# EAGLE design arduino_shield (EAGLE 6.6.0)

## Sheet 1 of 2: Arduino Sheild
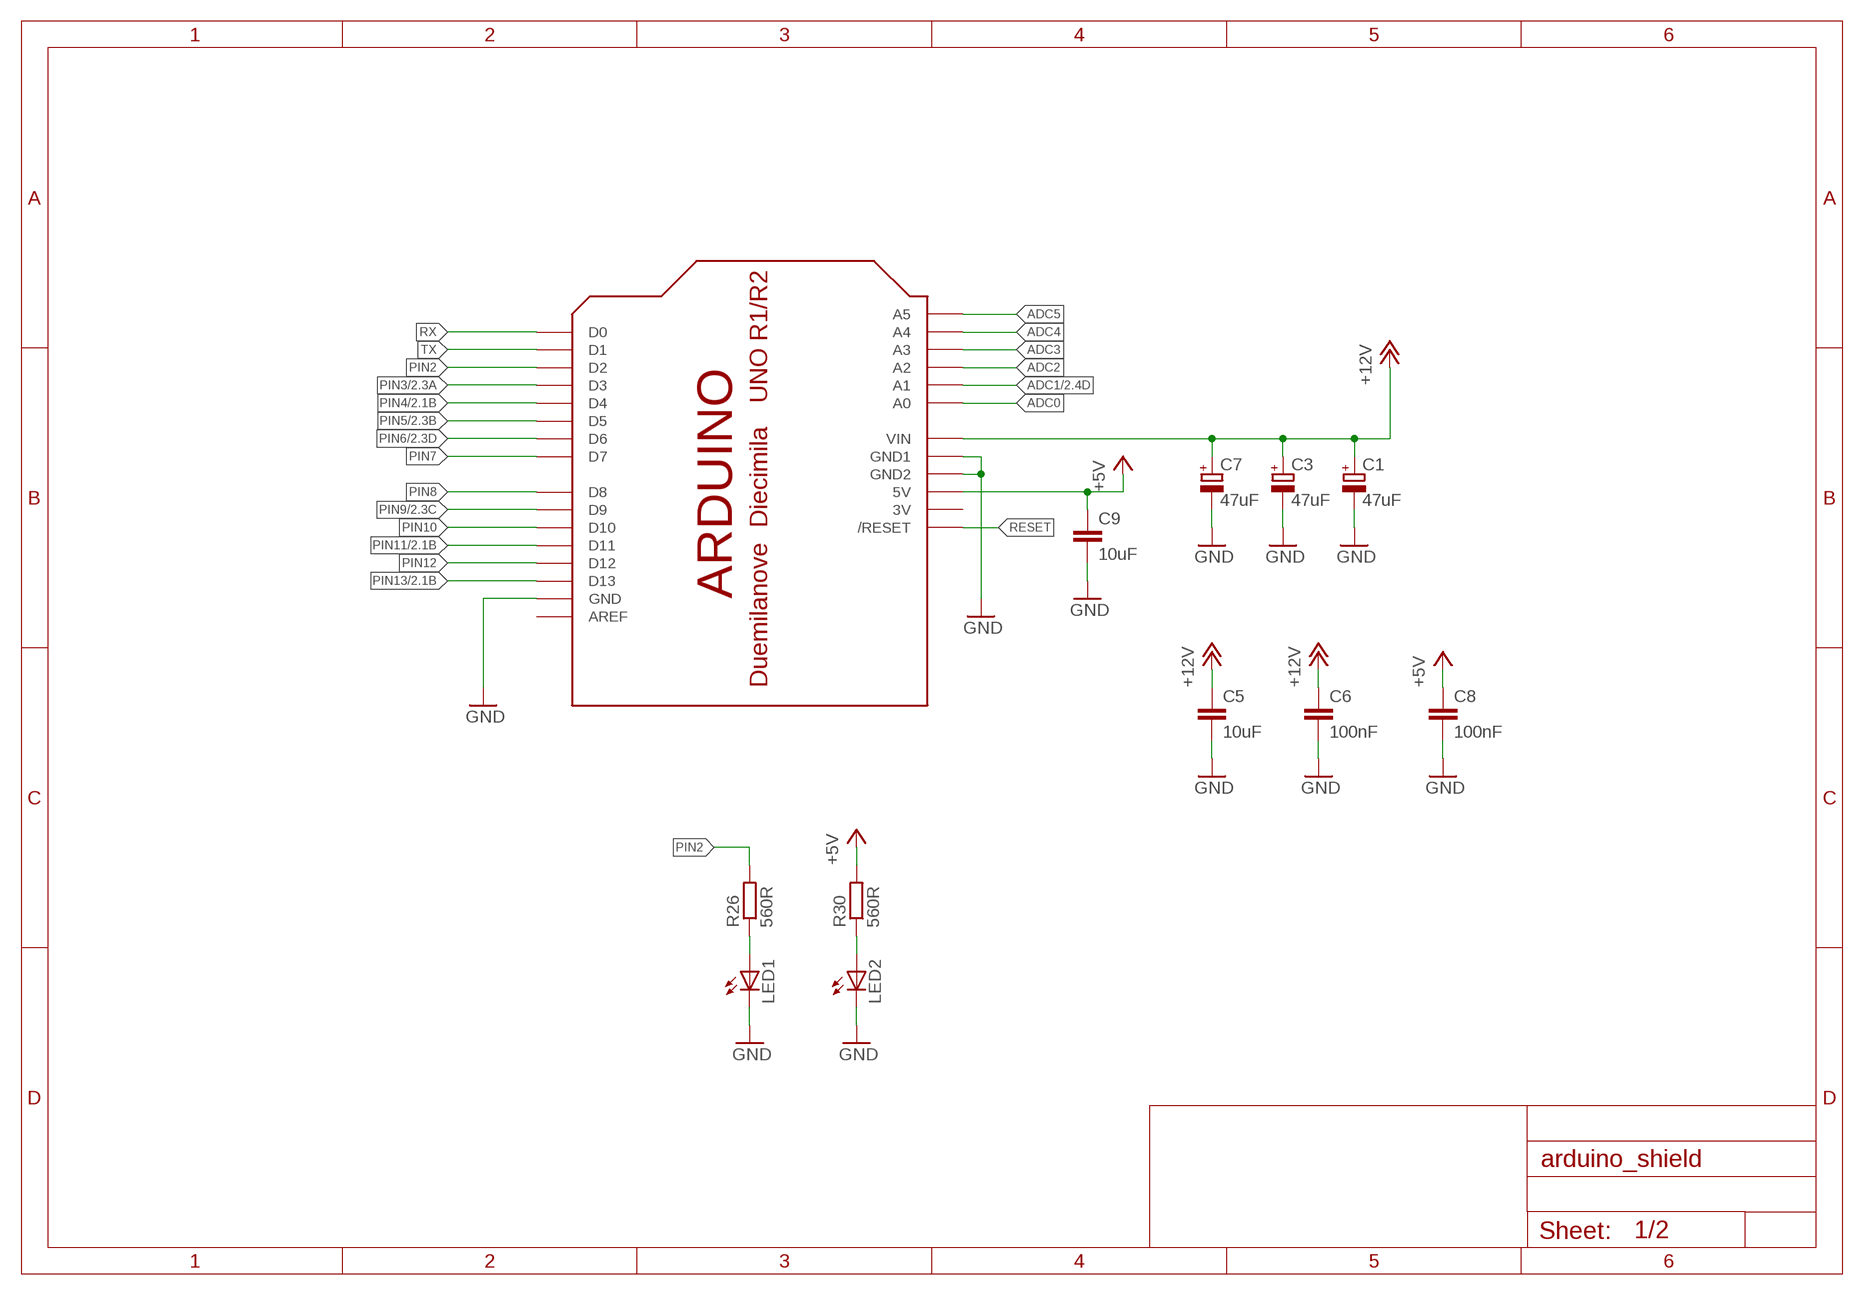
[diagram p0: schematic, sheet 1]

### Parts
C1  47uF  CPOL-EUE2.5-5  [E2,5-5]
C3  47uF  CPOL-EUE2.5-5  [E2,5-5]
C5  10uF  C-EUC0805K  [C0805K]
C6  100nF  C-EUC0805K  [C0805K]
C7  47uF  CPOL-EUE2.5-5  [E2,5-5]
C8  100nF  C-EUC0805K  [C0805K]
C9  10uF  C-EUC0805K  [C0805K]
GND  ARDUINOUNO  [ARDUINO]
LED1  LEDCHIP-LED0805  [CHIP-LED0805]
LED2  LEDCHIP-LED0805  [CHIP-LED0805]
R26  560R  R-EU_R0805  [R0805]
R30  560R  R-EU_R0805  [R0805]

### Nets
+5V: C8.1 C9.1 GND.5V R30.2 ; also sheet 2
+12V: C1.+ C3.+ C5.1 C6.1 C7.+ GND.VIN ; also sheet 2
ADC0: GND.A0
ADC1: GND.A1 ; also sheet 2
ADC2: GND.A2
ADC3: GND.A3
ADC4: GND.A4
ADC5: GND.A5
GND: C1.- C3.- C5.2 C6.2 C7.- C8.2 C9.2 GND.GND GND.GND1 GND.GND2 LED1.C LED2.C ; also sheet 2
N$8: LED1.A R26.1
N$9: LED2.A R30.1
PIN2: GND.D2 R26.2
PIN3: GND.D3 ; also sheet 2
PIN4: GND.D4 ; also sheet 2
PIN5: GND.D5 ; also sheet 2
PIN6: GND.D6 ; also sheet 2
PIN7: GND.D7
PIN8: GND.D8
PIN9: GND.D9 ; also sheet 2
PIN10: GND.D10
PIN11: GND.D11 ; also sheet 2
PIN12: GND.D12
PIN13: GND.D13 ; also sheet 2
RESET: GND.RESET(/RESET)
RX: GND.D0
TX: GND.D1
Unconnected: GND.AREF

## Sheet 2 of 2: Output stage
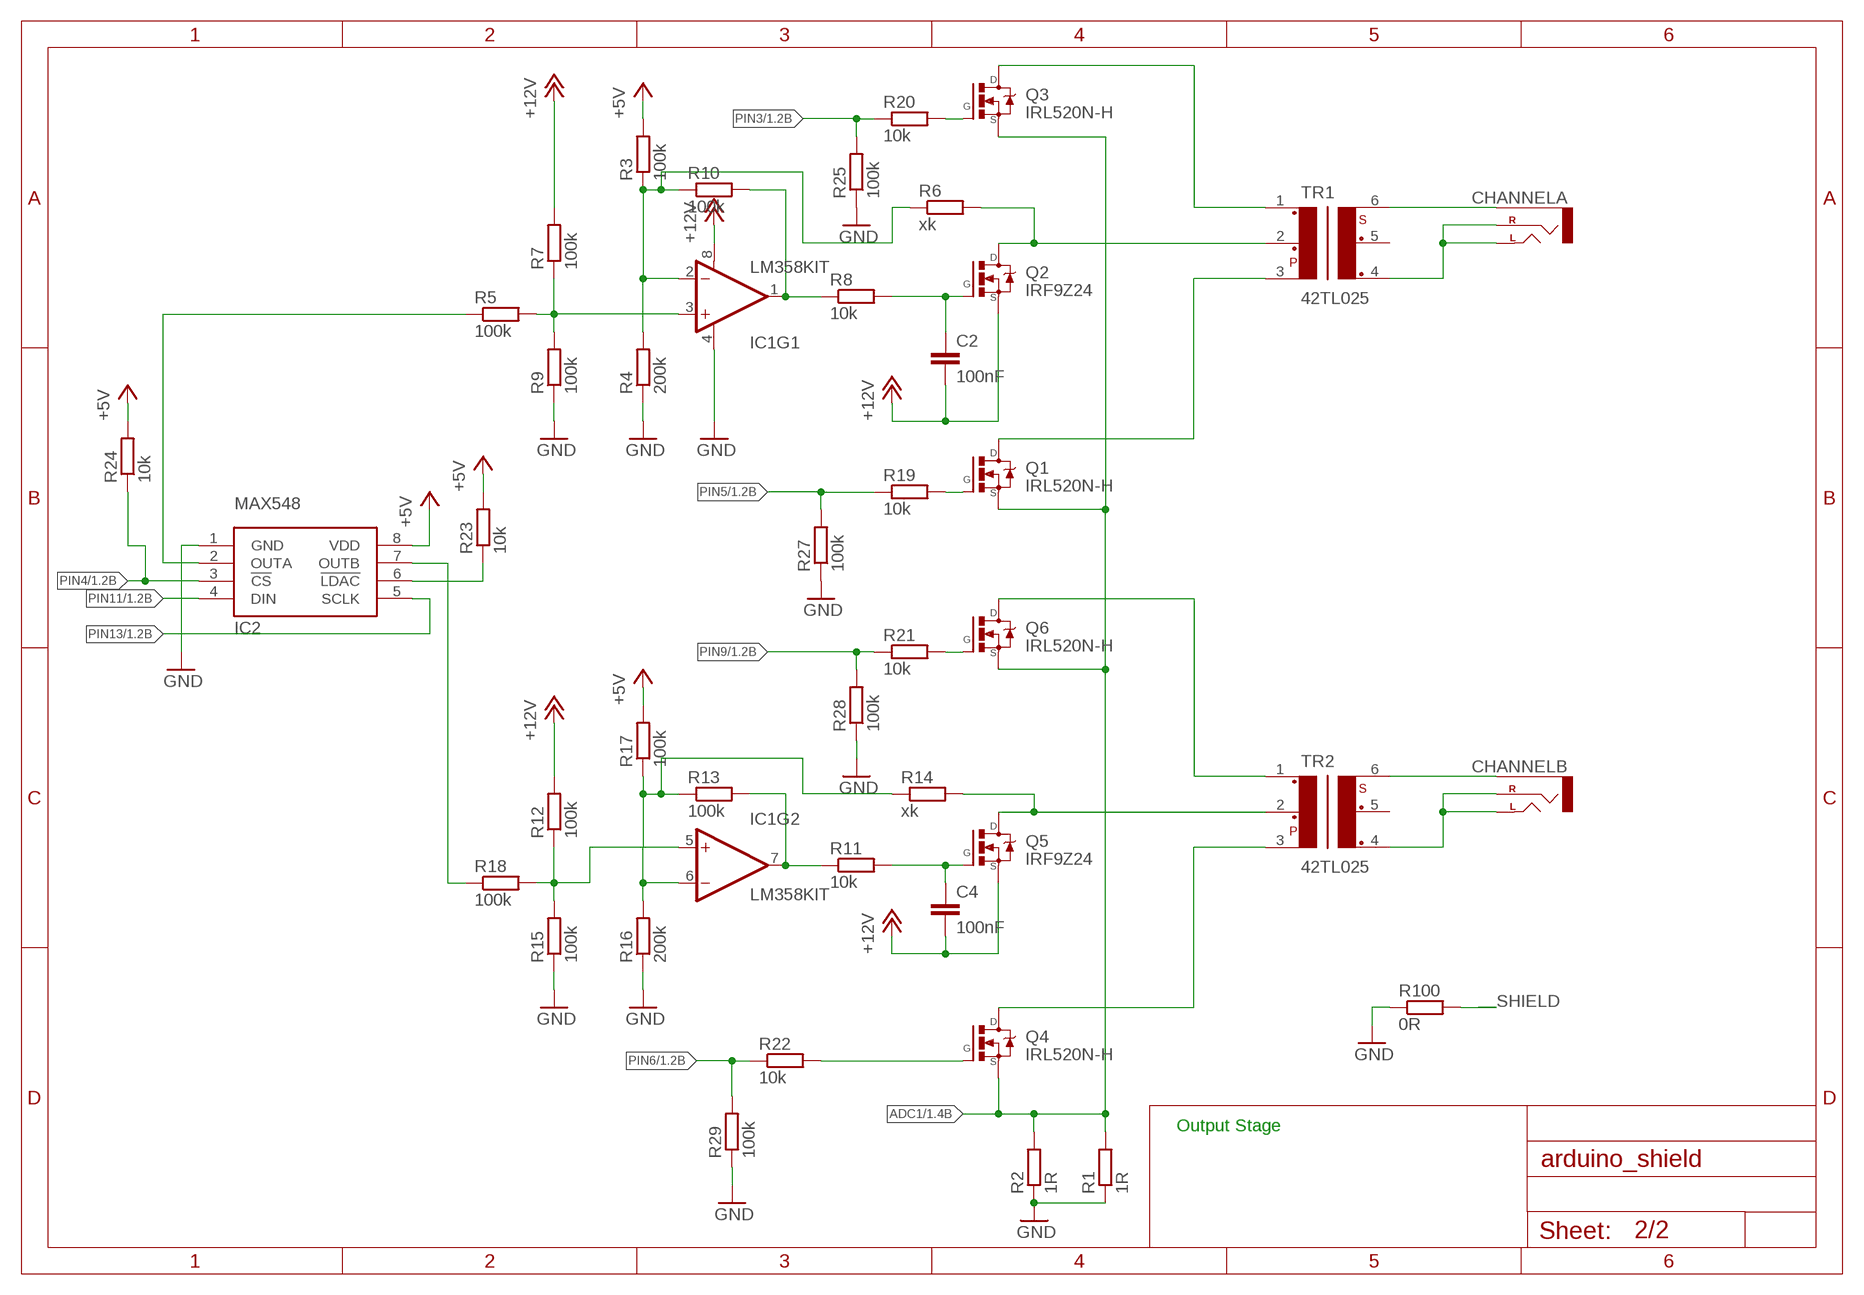
[diagram p1: schematic, sheet 2]

### Parts
C2  100nF  C2.5/2  [C2.5-2]
C4  100nF  C2.5/2  [C2.5-2]
CHANNELA  AUDIO-JACK2.5MM  [STEREOJACK2.5MM_STEREOJACK2.5MM]
CHANNELB  AUDIO-JACK2.5MM  [STEREOJACK2.5MM_STEREOJACK2.5MM]
IC1  LM358KIT  [DIP08-KIT]
IC2  MAX548  [DIL08]
Q1  IRL520N-H  IRL530N-V  [TO220V]
Q2  IRF9Z24  IRL530N-V  [TO220V]
Q3  IRL520N-H  IRL530N-V  [TO220V]
Q4  IRL520N-H  IRL530N-V  [TO220V]
Q5  IRF9Z24  IRL530N-V  [TO220V]
Q6  IRL520N-H  IRL530N-V  [TO220V]
R1  1R  R  [R0805]
R2  1R  R  [R0805]
R3  100k  R  [R0805]
R4  200k  R  [R0805]
R5  100k  R  [R0805]
R6  xk  R  [R0805]
R7  100k  R  [R0805]
R8  10k  R  [R0805]
R9  100k  R  [R0805]
R10  100k  R  [R0805]
R11  10k  R  [R0805]
R12  100k  R  [R0805]
R13  100k  R  [R0805]
R14  xk  R  [R0805]
R15  100k  R  [R0805]
R16  200k  R  [R0805]
R17  100k  R  [R0805]
R18  100k  R  [R0805]
R19  10k  R  [R0805]
R20  10k  R  [R0805]
R21  10k  R  [R0805]
R22  10k  R  [R0805]
R23  10k  R  [R0805]
R24  10k  R  [R0805]
R25  100k  R  [R0805]
R27  100k  R  [R0805]
R28  100k  R  [R0805]
R29  100k  R  [R0805]
R100  0R  R  [R0805]
TR1  42TL025  [42TL]
TR2  42TL025  [42TL]

### Nets
+5V: IC2.8(VDD) R3.2 R17.2 R23.2 R24.2 ; also sheet 1
+12V: C2.2 C4.2 IC1.8(V+) Q2.3(S) Q5.3(S) R7.2 R12.2 ; also sheet 1
ADC1: Q1.3(S) Q3.3(S) Q4.3(S) Q6.3(S) R1.2 R2.2 ; also sheet 1
GND: IC1.4(V-) IC2.1(GND) R1.1 R2.1 R4.1 R9.1 R15.1 R16.1 R25.1 R27.1 R28.1 R29.1 R100.1 ; also sheet 1
N$1: CHANNELA.RING1(SLEEVE) TR1.6
N$2: CHANNELB.RING1(SLEEVE) TR2.6
N$3: CHANNELB.SHIELD(LEFT) CHANNELB.TIP(RIGHT) TR2.4
N$4: CHANNELA.SHIELD(LEFT) CHANNELA.TIP(RIGHT) TR1.4
N$5: IC2.2(OUTA) R5.1
N$6: IC2.7(OUTB) R18.1
N$7: IC2.6(!LDAC) R23.1
N$18: Q3.1(G) R20.2
N$19: Q1.1(G) R19.2
N$20: IC1.1(OUT) R8.1 R10.2
N$21: C2.1 Q2.1(G) R8.2
N$22: IC1.3(+IN) R5.2 R7.1 R9.2
N$24: Q6.1(G) R21.2
N$25: Q4.1(G) R22.2
N$26: IC1.7(OUT) R11.1 R13.2
N$27: C4.1 Q5.1(G) R11.2
N$28: IC1.5(+IN) R12.1 R15.2 R18.2
N$34: Q3.2(D) TR1.1
N$35: Q2.2(D) R6.2 TR1.2
N$36: Q6.2(D) TR2.1
N$37: Q5.2(D) R14.2 TR2.2
N$38: Q4.2(D) TR2.3
N$39: Q1.2(D) TR1.3
N$40: IC1.2(-IN) R3.1 R4.2 R6.1 R10.1
N$41: IC1.6(-IN) R13.1 R14.1 R16.2 R17.1
PIN3: R20.1 R25.2 ; also sheet 1
PIN4: IC2.3(!CS) R24.1 ; also sheet 1
PIN5: R19.1 R27.2 ; also sheet 1
PIN6: R22.1 R29.2 ; also sheet 1
PIN9: R21.1 R28.2 ; also sheet 1
PIN11: IC2.4(DIN) ; also sheet 1
PIN13: IC2.5(SCLK) ; also sheet 1
SHIELD: R100.2
Unconnected: TR1.5 TR2.5

### Notes on the sheet
- Output Stage

## Power pins joined to a net without a drawn wire
3V: GND.3V

## Library data of the parts
C1 C3 C7 = rcl:CPOL-EU: POLARIZED CAPACITOR, European symbol
C2 C4 = capacitor-wima:C: CAPACITOR naming: grid - package width
C5 C6 C8 C9 = rcl:C-EU: CAPACITOR, European symbol
CHANNELA CHANNELB = SparkFun-Connectors:AUDIO-JACK: 3.5mm Audio Jack Simple 3.5mm common PCB mount audio jack. SKU: PRT-08032
GND = adafruit:ARDUINO: Arduino Diecimila/Duemilanove Make a shield with ease, this package has all the named pins as well as the two mounting drill holes and an outline of the USB and DC power connector. The outline is on the DIMENSION layer, so if your board house uses it they will cut the outline to match. http://www.ladyada.net/library/pcb/eaglelibrary.html
IC1 = SparkFun-AnalogIC:LM358: Jellybean op-amp; PROD_ID: IC-09172
IC2 = JAEB:MAX548
LED1 LED2 = adafruit:LED: LED OSRAM: - CHIPLED LG R971, LG N971, LY N971, LG Q971, LY Q971, LO R971, LY R971 LH N974, LH R974 LS Q976, LO Q976, LY Q976 LO Q996 - Hyper CHIPLED LW Q18S LB Q993, LB Q99A, LB R99A - SideLED LS A670, LO A670, LY A670, LG A670, LP A670 LB A673, LV A673, LT A673, LW A673 LH A674 LY A675 LS A676, LA A676, LO A676, LY A676, LW A676 LS A679, LY A679, LG A679 - Hyper Micro SIDELED® LS Y876, LA Y876, LO Y876, LY Y876 LT Y87S - SmartLED LW L88C, LW L88S LB L89C, LB L89S, LG L890 LS L89K, LO L89K, LY L89K LS L896, LA L896, LO L896, LY L896 - TOPLED LS T670, LO T670, LY T670, LG T670, LP T670 LSG T670, LSP T670, LSY T670, LOP T670, LYG T670 LG T671, LOG T671, LSG T671 LB T673, LV T673, LT T673, LW T673 LH T674 LS T676, LA T676, LO T676, LY T676, LB T676, LH T676, LSB T676, LW T676 LB T67C, LV T67C, LT T67C, LS T67K, LO T67K, LY T67K, LW E67C LS E67B, LA E67B, LO E67B, LY E67B, LB E67C, LV E67C, LT E67C LW T67C LS T679, LY T679, LG T679 LS T770, LO T770, LY T770, LG T770, LP T770 LB T773, LV T773, LT T773, LW T773 LH T774 LS E675, LA E675, LY E675, LS T675 LS T776, LA T776, LO T776, LY T776, LB T776 LHGB T686 LT T68C, LB T68C - Hyper Mini TOPLED® LB M676 - Mini TOPLED Santana® LG M470 LS M47K, LO M47K, LY M47K Source: http://www.osram.convergy.de/
Q1-Q6 = transistor-fet-1:IRL530: MOSFET 17A 22.7nC 100mOhm Logic Level
R1-R25 R27-R29 R100 = eagle-ltspice:R: RESISTOR, European symbol; SPICEMODEL: NONE; SPICEPREFIX: R
R26 R30 = rcl:R-EU_: RESISTOR, European symbol
TR1 TR2 = trafo-xicon:42T?*: Xicon Micro-Mini EI-12 Audio Transformers 42TL/42TC/42TM Series Source: http://www.mouser.com//catalog/specsheets/164201.pdf http://www.mouser.com/catalog/specsheets/114225.pdf http://www.mouser.com/catalog/specsheets/164267.pdf; OC_FARNELL: unknown; OC_NEWARK: unknown

## Net classes
0 default: width 0.3 mm
1 signal: width 0.254 mm
2 pwr: width 2 mm

## Board
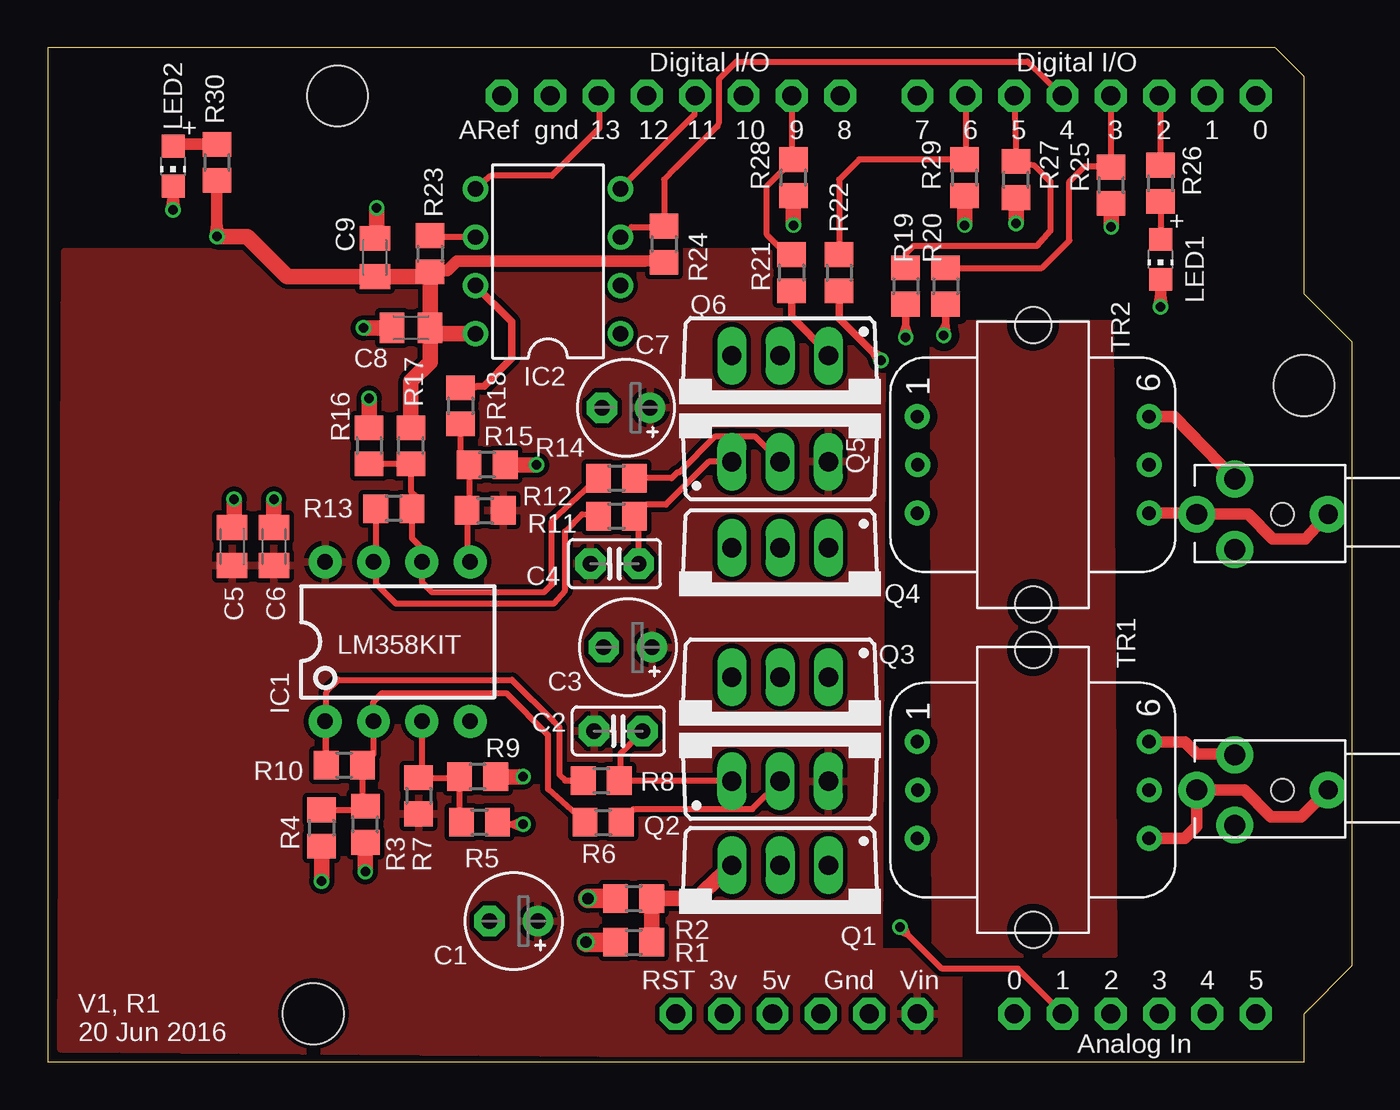
[diagram p2: board, top side]
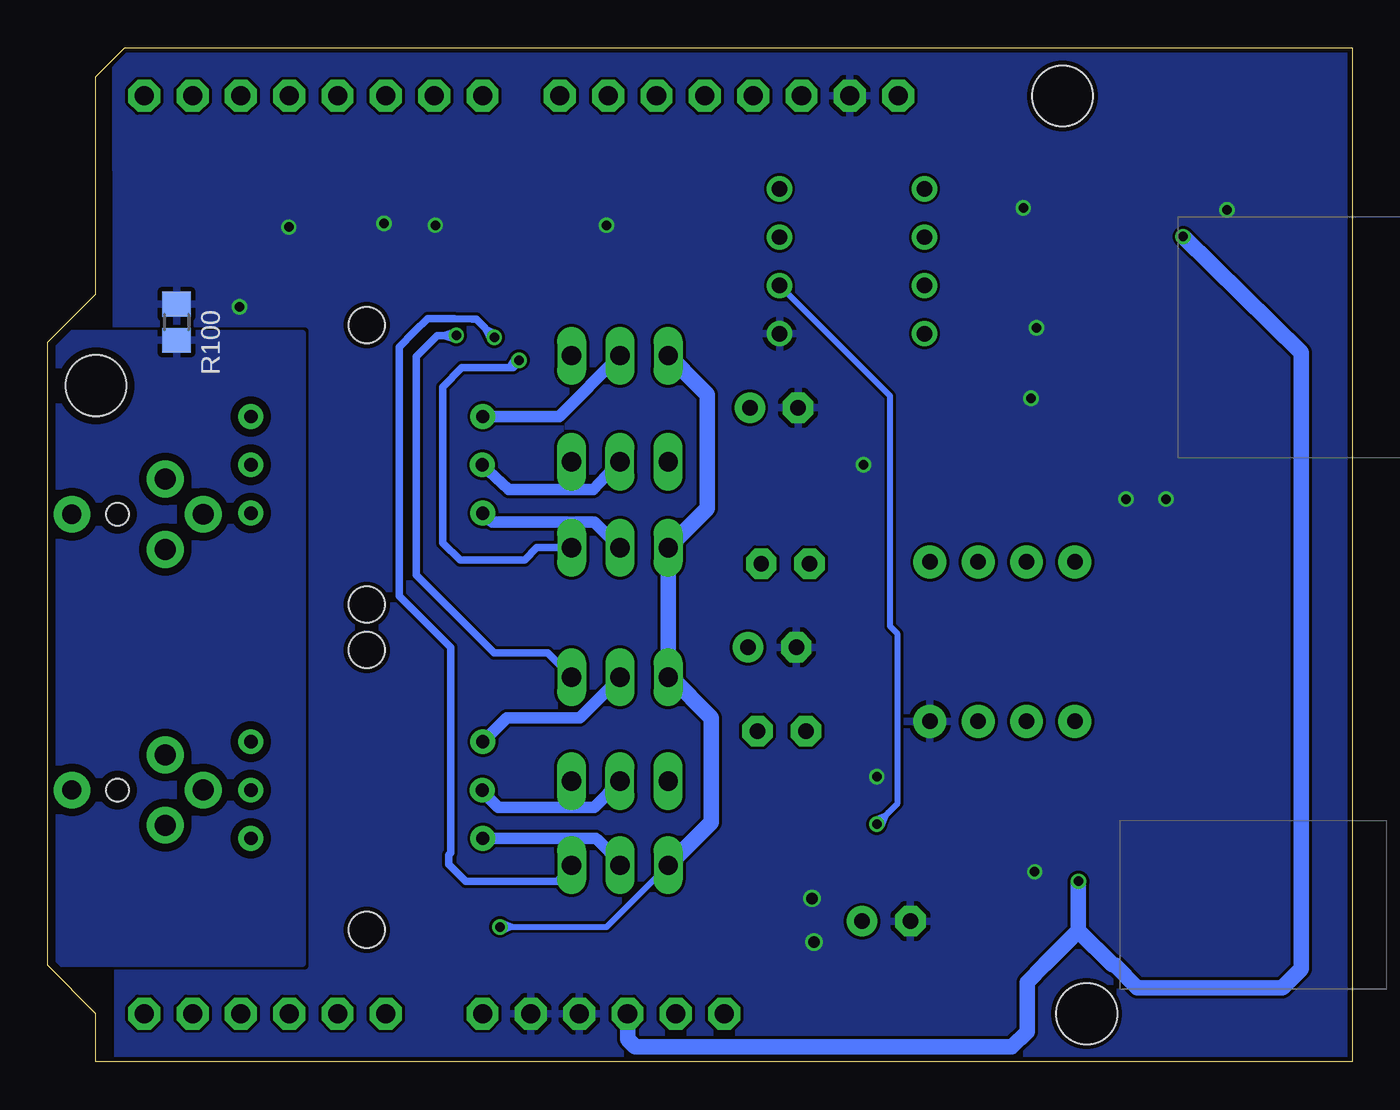
[diagram p3: board, bottom side, seen from below]

Size 68.58 x 53.34 mm. Coordinates in mm from the lower left corner, seen from the top.
Copper layers (1*16): Top 0.035mm / dielectric 1.5mm / Bottom 0.035mm
Design rules "Elecrow_2-layer_eagle_rule *": minimum track width 6mil, minimum drill 12mil, track to track 6mil, track to pad 6mil, pad to pad 6mil, via to via 6mil, smd to smd 0mil, copper to edge 10mil, drill to drill 10mil, minimum pad ring 10mil, minimum via ring 6mil, stop-mask expansion 2mil, vias tented up to drill 100mil, thermal gap 10mil

### Footprints (pad centres in the part's own frame; a part is rotated, then mirrored left to right if it is on the bottom)
E2,5-5 = drill 0.813 pad 1.6: + -1.27,0 | drill 0.813 pad 1.6 octagon: - 1.27,0
C2.5-2 = drill 0.813 pad 1.6 octagon: 1 -1.27,0; 2 1.27,0
C0805K = smd 1.3 x 1.6: 1 -1,0; 2 1,0
STEREOJACK2.5MM_STEREOJACK2.5MM = drill 1.1 pad 1.93: RING1 2.5,-1.85; RING2 2.5,1.85; TIP 4.5,0 | drill 1 pad 1.93: SHIELD -2.4,0 | hole 1.2: 0,0
ARDUINO = drill 1 pad 1.676 octagon: 3V 35.56,2.54; 5V 38.1,2.54; A0 50.8,2.54; A1 53.34,2.54; A2 55.88,2.54; A3 58.42,2.54; A4 60.96,2.54; A5 63.5,2.54; AREF 23.876,50.8; D0 63.5,50.8; D1 60.96,50.8; D2 58.42,50.8; D3 55.88,50.8; D4 53.34,50.8; D5 50.8,50.8; D6 48.26,50.8; D7 45.72,50.8; D8 41.656,50.8; D9 39.116,50.8; D10 36.576,50.8; D11 34.036,50.8; D12 31.496,50.8; D13 28.956,50.8; GND 26.416,50.8; GND1 43.18,2.54; GND2 40.64,2.54; RESET 33.02,2.54; VIN 45.72,2.54 | hole 3.2: 15.24,50.8; 66.04,35.56; 13.97,2.54
DIP08-KIT = drill 0.813 pad 1.727: 1 -3.81,-4.191; 2 -1.27,-4.191; 3 1.27,-4.191; 4 3.81,-4.191; 5 3.81,4.191; 6 1.27,4.191; 7 -1.27,4.191; 8 -3.81,4.191
DIL08 = drill 0.813 pad 1.27: 1 -3.81,-3.81; 2 -1.27,-3.81; 3 1.27,-3.81; 4 3.81,-3.81; 5 3.81,3.81; 6 1.27,3.81; 7 -1.27,3.81; 8 -3.81,3.81
CHIP-LED0805 = smd 1.2 x 1.2: A 0,-1.05; C 0,1.05
TO220V = drill 1.016 long: 1 -2.54,-2.54; 2 0,-2.54; 3 2.54,-2.54
R0805 = smd 1.3 x 1.5: 1 -0.95,0; 2 0.95,0
42TL = drill 0.7 pad 1.3: 1 -2.54,-6.096; 2 0,-6.068; 3 2.54,-6.096; 4 2.54,6.096; 5 0,6.096; 6 -2.54,6.096 | hole 1.9: -7.353,0; 7.353,0

### Placement (x,y rotation side)
C1  24.5,7.4 180 top
C2  30,17.4 180 top
C3  30.5,21.8 180 top
C4  29.8,26.2 180 top
C5  9.7,27.1 90 top
C6  11.9,27.1 90 top
C7  30.4,34.4 180 top
C8  19.1,38.6 180 top
C9  17.2,42.3 90 top
CHANNELA  64.9,14.3 180 top
CHANNELB  64.9,28.8 180 top
GND  0,0 0 top
IC1  18.4,22.1 0 top
IC2  26.3,42.1 90 top
LED1  58.5,42.2 180 top
LED2  6.6,47.1 180 top
Q1  38.5,7.8 180 top
Q2  38.5,17.3 0 top
Q3  38.5,17.7 180 top
Q4  38.5,24.5 180 top
Q5  38.5,34.1 0 top
Q6  38.5,34.6 180 top
R1  30.8,6.3 0 top
R2  30.8,8.6 0 top
R3  14.4,12.3 270 top
R4  16.7,12.5 90 top
R5  22.7,12.6 180 top
R6  29.2,12.6 0 top
R7  19.5,14 270 top
R8  29.1,14.8 0 top
R9  22.6,15 180 top
R10  15.6,15.6 180 top
R11  29.9,28.7 0 top
R12  23,29 0 top
R13  18.2,29.1 180 top
R14  29.9,30.7 0 top
R15  23.1,31.4 180 top
R16  16.9,32.4 270 top
R17  19.1,32.4 90 top
R18  21.7,34.5 270 top
R19  45.1,40.8 270 top
R20  47.2,40.8 270 top
R21  39.1,41.5 270 top
R22  41.6,41.5 270 top
R23  20.1,42.5 270 top
R24  32.4,43 270 top
R25  55.9,46.1 90 top
R26  58.5,46.2 90 top
R27  50.9,46.4 90 top
R28  39.2,46.5 90 top
R29  48.2,46.5 90 top
R30  8.9,47.3 270 top
R100  61.8,38.9 270 bottom
TR1  51.8,14.3 270 top
TR2  51.8,31.4 270 top

### Tracks (layer width: path | path; a pad name or v marks a point on that pad's centre or on a via)
+5V  (via drill 0.5)
  Top 0.61: R24.2 32.05,42.15 31.4,42.1 23.76,42.1 22.1,42.1 21.5,42.1 21,41.6 20.15,41.6 R23.2 | v8.9,43.4 R30.2 | v8.9,43.4 8.8,43.41 8.9,44.02 9,43.41 v8.9,43.4
  Top 0.813: R3.2 v14.4,9.5 | v8.9,43.4 10.5,43.4 12.6,41.3 C9.1 19.85,41.3 R23.2 C8.1 | IC2.8 20.41,38.29 C8.1 | R17.2 19.1,35.8 20.1,36.8 C8.1
  Bottom 0.813: v14.4,9.5 14.4,8.8 14.4,6.9 | GND.5V 38.1,1.2 37.7,0.8 17.9,0.8 17.1,1.6 17.1,4.2 16.2,5.1 14.4,6.9 | v8.9,43.4 2.7,37.3 2.7,4.9 3.7,3.9 11.3,3.9 12.5,5.1 12.6,5.1 14.4,6.9
+12V
  pour Top (isolate 0.254): 47.9,0.3 47.9,5.8 43.7,5.8 43.9,42.6 0.9,42.6 0.7,0.7
ADC1  (via drill 0.5)
  Top 0.305: GND.A1 53.34,2.56 51,4.9 47,4.9 v44.8,7.1 | v44.8,7.1 45.03,7.19 45.24,6.66 44.71,6.87 v44.8,7.1
  Top 0.813: R1.2 R2.2 34.12,8.6 Q1.3
  Bottom 0.305: v44.8,7.1 39.2,7.1 Q1.3 | v44.8,7.1 44.7,6.87 44.17,7.1 44.7,7.33 v44.8,7.1
  Bottom 0.813: Q6.3 35.94,37.14 34.3,35.5 33.9,35.1 33.9,29.1 Q4.3 Q3.3 35.84,20.24 33.7,18.1 33.7,12.6 Q1.3
GND  (via drill 0.5, 0.6)
  Top 0.61: LED1.C v58.5,39.7 | LED2.C v6.6,44.8 | v58.5,39.7 58.4,39.72 58.5,40.33 58.6,39.72 v58.5,39.7 | v6.6,44.8 6.5,44.81 6.6,45.42 6.7,44.81 v6.6,44.8
  Top 0.813: R16.1 v16.9,34.9 | R15.1 v25.7,31.4 | R9.1 v25,15 | R4.1 v16.7,10 | R27.1 v50.9,44.1 | R25.1 v55.9,43.9 | R28.1 v39.2,44 | C9.2 17.3,43.8 v17.3,44.9 | R29.1 v48.2,44 | C6.2 v11.9,29.6 | C8.2 v16.6,38.6 | C5.2 9.8,28.1 v9.8,29.6
  Top 1.016: R2.1 v28.4,8.6 | R1.1 v28.3,6.3
  pour Bottom (rank 3): -0.13,52.17 -0.13,-0.16 64.9,-0.26 65,53.6 -0.1,53.7 -0.1,52.1
N$1
  Top 0.61: TR1.6 59.76,16.84 60.4,16.2 62.35,16.2 CHANNELA.RING1
N$2
  Top 0.61: TR2.6 59.21,33.94 CHANNELB.RING1
N$3
  Top 0.61: TR2.4 60.44,28.86 CHANNELB.TIP 63.1,28.8 64.4,27.5 66.1,27.5 CHANNELB.SHIELD
N$4
  Top 0.61: TR1.4 59.76,11.76 60.4,12.4 CHANNELA.TIP 62.9,14.3 64.3,12.9 65.9,12.9 CHANNELA.SHIELD
N$5  (via drill 0.5)
  Top 0.305: IC2.2 30.03,40.83 | v25,12.5 24.9,12.5 23.65,12.5 R5.1 | v25,12.5 24.9,12.27 24.38,12.5 24.9,12.73 v25,12.5
  Bottom 0.305: IC2.2 24.3,35.02 24.3,22.9 23.9,22.5 23.9,13.6 24.4,13.1 v25,12.5 | v25,12.5 24.77,12.41 24.56,12.94 25.09,12.73 v25,12.5
N$6
  Top 0.406: R18.1 22.95,35.55 24.4,37 24.4,38.92 IC2.7
N$7
  Top 0.305: IC2.6 20.72,43.37 R23.1
N$8
  Top 0.305: R26.1 LED1.A
N$9
  Top 0.61: R30.1 6.7,48.25 LED2.A
N$18  (via drill 0.5)
  Top 0.406: R20.2 47.2,38.3 v47.1,38.2 | v47.1,38.2 46.92,38.29 47.2,38.82 47.3,38.23 v47.1,38.2
  Bottom 0.406: Q3.1 42.3,21.5 45.1,21.5 49.2,25.6 49.2,37.1 48.1,38.2 v47.1,38.2 | v47.1,38.2 47.16,38.39 47.73,38.2 47.16,38.01 v47.1,38.2
N$19  (via drill 0.5)
  Top 0.406: R19.2 v45.1,38.1 | v45.1,38.1 44.91,38.16 45.1,38.73 45.29,38.16 v45.1,38.1
  Bottom 0.406: v45.1,38.1 46.05,39.05 46.25,39.05 47.2,39.1 48.6,39.1 49.3,38.4 50.1,37.6 50.1,24.5 47.4,21.8 47.4,19.7 47.4,11 47.5,10.9 47.5,10.4 46.6,9.5 41.8,9.5 41.04,10.26 Q1.1 | v45.1,38.1 45.01,38.28 45.54,38.54 45.28,38.01 v45.1,38.1
N$20
  Top 0.305: IC1.1 14.59,15.66 R10.2 14.65,19.45 15.3,20.1 24.4,20.1 26.6,17.9 26.9,17.6 26.9,15.1 27.2,14.8 27.95,14.8 R8.1
N$21
  Top 0.305: Q2.1 35.92,14.8 R8.2 30.1,14.85 30.1,16.2 31.27,17.37 C2.1
N$22
  Top 0.305: IC1.3 19.67,15.12 R7.1 21.6,14.95 R9.2 21.65,12.7 R5.2
N$24
  Top 0.406: Q6.1 41.04,37.26 39.1,39.2 R21.2
N$25  (via drill 0.5)
  Top 0.406: R22.2 41.6,39.1 v43.8,36.9 | v43.8,36.9 43.62,36.81 43.36,37.34 43.89,37.08 v43.8,36.9
  Bottom 0.406: v43.8,36.9 43.8,36.8 44.1,36.5 46.8,36.5 47.8,35.5 47.8,27.3 46.9,26.4 43.5,26.4 42.86,27.04 Q4.1 | v43.8,36.9 43.97,37 44.28,36.5 43.73,36.71 v43.8,36.9
N$26
  Top 0.305: R13.2 17.25,26.41 | 17.25,26.41 IC1.7 | 17.25,26.41 17.25,25.15 18.3,24.1 23.4,24.1 26.6,24.1 27.2,24.8 27.2,25.4 27.2,27.9 28.1,28.8 R11.1
N$27
  Top 0.305: Q5.1 34.76,31.56 32.5,29.3 31.45,29.3 R11.2 31.07,28.48 C4.1
N$28
  Top 0.305: R12.1 22.05,28.3 | 22.05,28.3 22.05,26.45 IC1.5 | R18.2 21.95,33.55 21.7,33 21.7,31.85 R15.2 22.15,28.4 22.05,28.3
N$34
  Bottom 0.61: Q3.2 38.5,20.2 40,18.7 40.6,18.1 44.44,18.1 TR1.1
N$35
  Top 0.305: R6.2 30.1,12.2 30.8,13.3 37.04,13.3 Q2.2
  Bottom 0.61: TR1.2 45.73,14.23 44.9,13.4 39.86,13.4 Q2.2
N$36
  Bottom 0.61: TR2.1 41.7,33.94 Q6.2
N$37
  Top 0.305: Q5.2 37.16,32.9 35.1,32.9 33.2,31 33.1,31 32.8,30.7 R14.2
  Bottom 0.61: Q5.2 38.54,31.56 39.9,30.1 44.33,30.1 TR2.2
N$38
  Bottom 0.61: TR2.3 45.66,28.86 45.2,28.4 39.86,28.4 Q4.2
N$39
  Bottom 0.61: Q1.2 38.5,10.5 39.7,11.7 39.76,11.76 TR1.3
N$40
  Top 0.305: R3.1 16.5,13.25 R4.2 16.55,13.6 R10.1 17.13,16.18 IC1.2 17.13,18.93 17.6,19.4 24.1,19.4 26.3,17.2 26.3,14.35 R6.1
N$41
  Top 0.305: R16.2 R17.1 19.1,30 19.4,29.7 19.4,29.35 R13.1 19.15,27.55 19.8,26.9 19.8,26.42 IC1.6 19.67,25.23 20.2,24.7 26.1,24.7 26.5,25.1 26.5,28.45 R14.1
PIN2
  Top 0.305: R26.2 58.5,50.72 GND.D2
PIN3
  Top 0.305: GND.D3 55.88,47.07 R25.2 55.85,47.1 54.5,47.1 53.7,46.3 53.7,43.2 52.25,41.75 R20.1
PIN4
  Top 0.305: GND.D4 51.5,52.6 36.2,52.6 35.3,51.7 35.3,49.4 35.2,49.2 33,47 32.4,46.4 R24.1 | IC2.3 30.11,43.41 30.7,43.9 32.15,43.9
  Top 0.813: 32.15,43.9 32.35,43.9 R24.1
PIN5
  Top 0.305: R19.1 45.1,42.5 45.5,42.9 51.1,42.9 51.4,42.9 52,42.9 52.7,43.7 52.7,46.3 51.85,47.15 R27.2 GND.D5
PIN6
  Top 0.305: GND.D6 48.26,47.51 R29.2 42.65,47.45 41.6,46.4 R22.1
PIN9
  Top 0.305: R21.1 38.85,42.45 37.8,43.5 37.8,46.05 R28.2 39.12,47.53 GND.D9
PIN11
  Top 0.305: GND.D11 34,49.8 IC2.4
PIN13
  Top 0.305: GND.D13 29,49.1 26.5,46.6 23.3,46.6 IC2.5
SHIELD
  pour Bottom (isolate 0.406): 55.2,38.3 68.1,38.3 68,5.2 55.2,5.2
SHIELD2
  pour Top (isolate 0.406, no thermals): 46.5,38.9 55.9,38.9 56.1,5.6 46.6,5.6

### Text on the board
tNames: V1, R1 / 20 Jun 2016